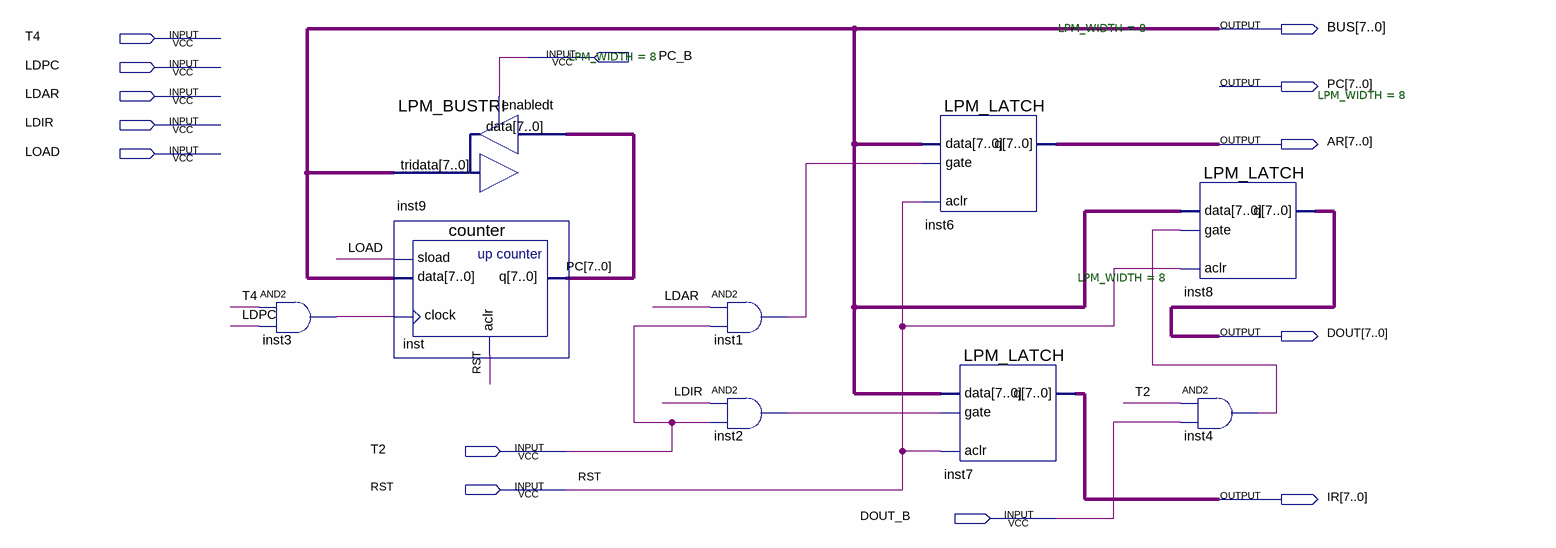
[diagram p0: schematic sheet]
// Quartus schematic REGS_MD.bdf as structural Verilog: 9 symbols, 14 pins
module REGS_MD (
  input  T4,
  input  PC_B,
  input  LDPC,
  input  LDAR,
  input  LDIR,
  input  LOAD,
  input  T2,
  input  RST,
  input  DOUT_B,
  output [7:0] BUS,
  output [7:0] PC,
  output [7:0] AR,
  output [7:0] DOUT,
  output [7:0] IR
);

  wire inst1_out, inst2_out, inst3_out, inst4_out;

  and inst3 (inst3_out, T4, LDPC);
  LPM_BUSTRI #(.LPM_WIDTH(8)) inst9 (.data(PC), .enabledt(PC_B), .tridata(BUS));
  counter inst (.sload(LOAD), .data(BUS), .clock(inst3_out), .aclr(RST), .q(PC));
  and inst1 (inst1_out, LDAR, T2);
  and inst2 (inst2_out, LDIR, T2);
  LPM_LATCH #(.LPM_WIDTH(8)) inst6 (.aclr(RST), .data(BUS), .gate(inst1_out), .q(AR));
  LPM_LATCH #(.LPM_WIDTH(8)) inst7 (.aclr(RST), .data(BUS), .gate(inst2_out), .q(IR));
  LPM_LATCH #(.LPM_WIDTH(8)) inst8 (.aclr(RST), .data(BUS), .gate(inst4_out), .q(DOUT));
  and inst4 (inst4_out, T2, DOUT_B);
endmodule
